# Altium schematic sheet STM32F103C8T6.SchDoc
size A3; SheetNumber: 1; SheetTotal: 6
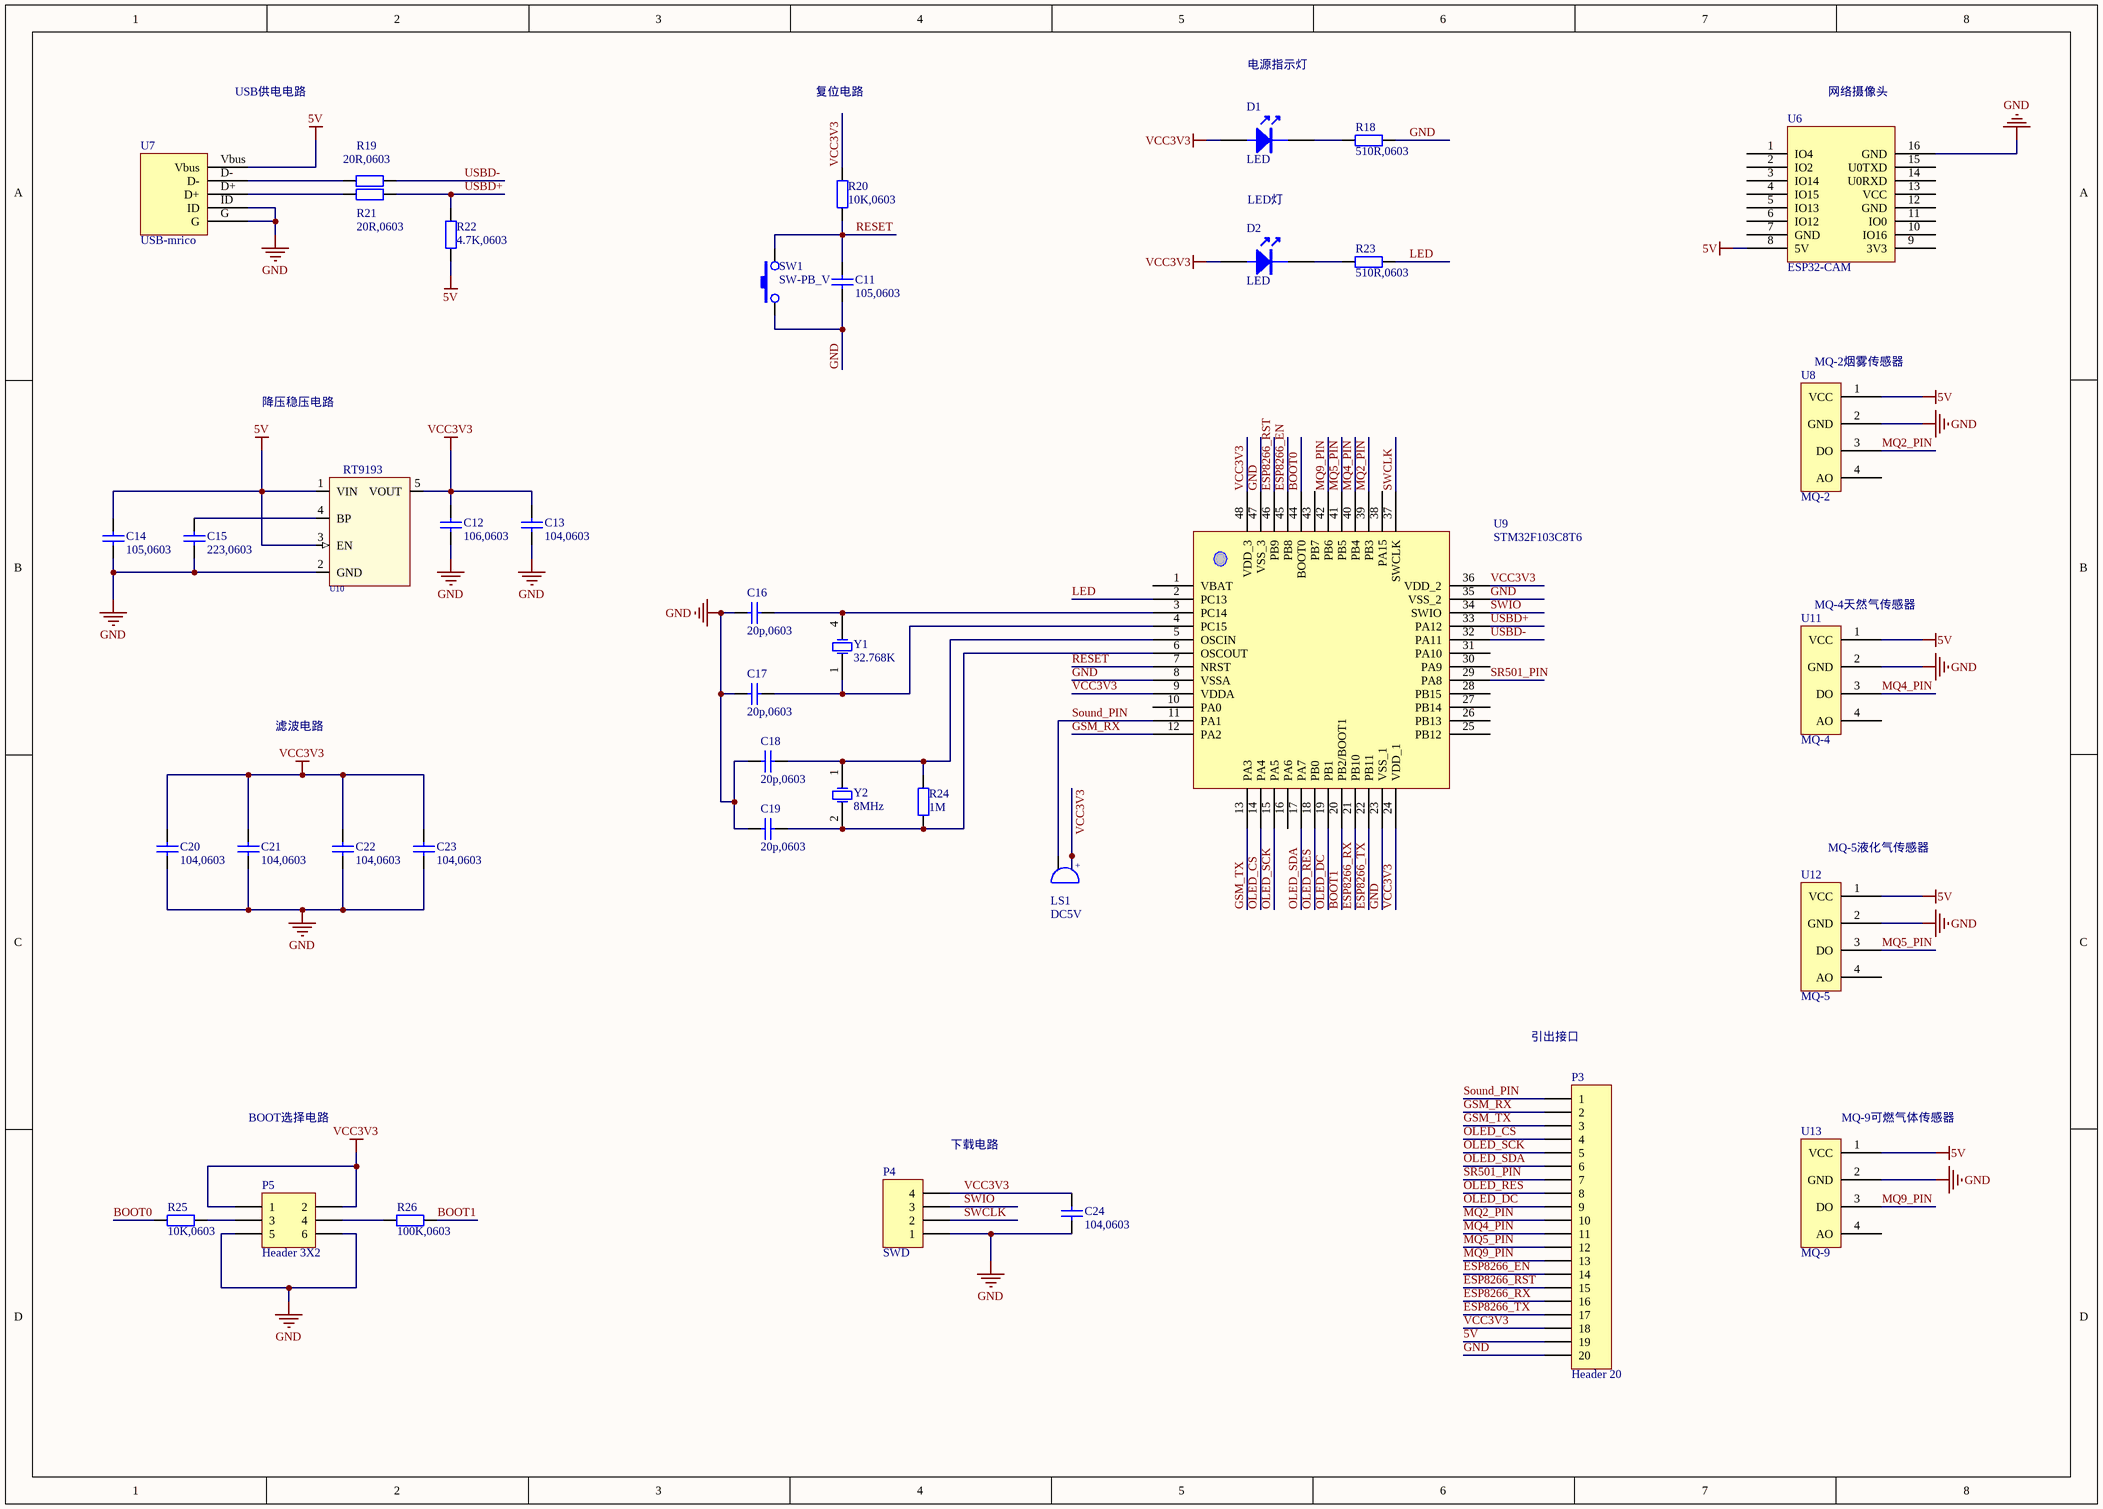
[diagram p0: STM32F103C8T6.SchDoc]

## Parts
C11  105,0603  [C0603]
C12  106,0603  [C0603]
C13  104,0603  [C0603]
C14  105,0603  [C0603]
C15  223,0603  [C0603]
C16  20p,0603  [C0603]
C17  20p,0603  [C0603]
C18  20p,0603  [C0603]
C19  20p,0603  [C0603]
C20  104,0603  [C0603]
C21  104,0603  [C0603]
C22  104,0603  [C0603]
C23  104,0603  [C0603]
C24  104,0603  [C0603]
D1  LED  [LED]
D2  LED  [LED]
LS1  DC5V  [BEEP 5x9x5.5]
P3  Header 20  [HDR1X20]
P4  SWD  [HDR1X4]
P5  Header 3X2  [HDR2X3]
R18  510R,0603  [R0603]
R19  20R,0603  [R0603]
R20  10K,0603  [R0603]
R21  20R,0603  [R0603]
R22  4.7K,0603  [R0603]
R23  510R,0603  [R0603]
R24  1M  [R0603]
R25  10K,0603  [R0603]
R26  100K,0603  [R0603]
SW1  SW-PB_V  [KEY-SMT]
U6  ESP32-CAM
U7  USB-mrico  [Micro_USB]
U8  MQ-2
U9  STM32F103C8T6  [48P]
U10  RT9193  [SOT-23-5]
U11  MQ-4
U12  MQ-5
U13  MQ-9
Y1  32.768K  [X/2.5/2/6/2.5]
Y2  8MHz  [X/2.5/2/6/2.5]

## Nets
5V: C14.2 P3.19 R22.1 U6.8(5V) U7.Vbus U8.1(VCC) U10.1(VIN) U10.3(EN) U11.1(VCC) U12.1(VCC) U13.1(VCC)
GND: C11.1 C12.1 C13.1 C14.1 C15.1 C16.2 C17.2 C18.2 C19.2 C20.1 C21.1 C22.1 C23.1 C24.1 P3.20 P4.1 P5.5 P5.6 R18.2 SW1.1 U6.16(GND) U7.G U7.ID U8.2(GND) U9.8(VSSA) U9.23(VSS_1) U9.35(VSS_2) U9.47(VSS_3) U10.2(GND) U11.2(GND) U12.2(GND) U13.2(GND)
VCC3V3: C12.2 C13.2 C20.2 C21.2 C22.2 C23.2 C24.2 D1.A D2.A LS1.1 P3.18 P4.4 P5.1 P5.2 R20.2 U9.9(VDDA) U9.24(VDD_1) U9.36(VDD_2) U9.48(VDD_3) U10.5(VOUT)
BOOT0: R25.2 U9.44(BOOT0)
BOOT1: R26.1 U9.20(PB2/BOOT1)
ESP8266_EN: P3.14 U9.45(PB8)
ESP8266_RST: P3.15 U9.46(PB9)
ESP8266_RX: P3.16 U9.21(PB10)
ESP8266_TX: P3.17 U9.22(PB11)
GSM_RX: P3.2 U9.12(PA2)
GSM_TX: P3.3 U9.13(PA3)
LED: R23.2 U9.2(PC13)
MQ2_PIN: P3.10 U8.3(DO) U9.39(PB3)
MQ4_PIN: P3.11 U9.40(PB4) U11.3(DO)
MQ5_PIN: P3.12 U9.41(PB5) U12.3(DO)
MQ9_PIN: P3.13 U9.42(PB6) U13.3(DO)
OLED_CS: P3.4 U9.14(PA4)
OLED_DC: P3.9 U9.19(PB1)
OLED_RES: P3.8 U9.18(PB0)
OLED_SCK: P3.5 U9.15(PA5)
OLED_SDA: P3.6 U9.17(PA7)
RESET: C11.2 R20.1 SW1.2 U9.7(NRST)
Sound_PIN: LS1.2 P3.1 U9.11(PA1)
SR501_PIN: P3.7 U9.29(PA8)
SWCLK: P4.2 U9.37(SWCLK)
SWIO: P4.3 U9.34(SWIO)
USBD+: R21.1 R22.2 U9.33(PA12)
USBD-: R19.2 U9.32(PA11)
NetC15_2: C15.2 U10.4(BP)
NetC16_1: C16.1 U9.3(PC14) Y1.4(OSC2)
NetC17_1: C17.1 U9.4(PC15) Y1.1(OSC1)
NetC18_1: C18.1 R24.2 U9.5(OSCIN) Y2.1(OSC1)
NetC19_1: C19.1 R24.1 U9.6(OSCOUT) Y2.2(OSC2)
NetD1_K: D1.K R18.1
NetD2_K: D2.K R23.1
NetP5_3: P5.3 R25.1
NetP5_4: P5.4 R26.2
NetR19_1: R19.1 U7.D-
NetR21_2: R21.2 U7.D+

Not connected (* = marked no-connect by the designer): U6 1(IO4) 2(IO2) 3(IO14) 4(IO15) 5(IO13) 6(IO12) 7(GND) 9(3V3) 10(IO16) 11(IO0) 12(GND) 13(VCC) 14(U0RXD) 15(U0TXD); U8 4(AO); U9 1(VBAT) 10(PA0) 16(PA6) 25(PB12) 26(PB13) 27(PB14) 28(PB15) 30(PA9) 31(PA10) 38(PA15) 43(PB7); U11 4(AO); U12 4(AO); U13 4(AO)

## Notes on the sheet
- USB供电电路
- 复位电路
- 电源指示灯
- 网络摄像头
- LED灯
- (near U8) MQ-2烟雾传感器
- 降压稳压电路
- (near U11) MQ-4天然气传感器
- 滤波电路
- (near U12) MQ-5液化气传感器
- 引出接口
- BOOT选择电路
- (near U13) MQ-9可燃气体传感器
- (near P4) 下载电路
- (in symbol BEEP) +

## Library data of the parts
C11-C24 = Cap: Capacitor; Value: 104; Published: 8-Jun-2000; LatestRevisionDate: 17-Jul-2002; LatestRevisionNote: Re-released for DXP Platform.; Publisher: Altium Limited
D1 D2 = LED: pin to pad: A>1 K>2
LS1 = BEEP: 蜂鸣器; 联系下单店铺卖家 免费技术支持: 联系下单店铺卖家 免费帮你查找封装; BOM名称: 蜂鸣器
P3 = Header 20: Header, 20-Pin; LatestRevisionDate: 17-Jul-2002; LatestRevisionNote: Re-released for DXP Platform.; Publisher: Altium Limited
P4 = Header 4: Header, 4-Pin; LatestRevisionDate: 17-Jul-2002; LatestRevisionNote: Re-released for DXP Platform.; Publisher: Altium Limited
P5 = Header 3X2: Header, 3-Pin, Dual row; LatestRevisionDate: 17-Jul-2002; LatestRevisionNote: Re-released for DXP Platform.; Publisher: Altium Limited
R18-R26 = Res2: Resistor; Published: 8-Jun-2000; LatestRevisionDate: 17-Jul-2002; LatestRevisionNote: Re-released for DXP Platform.; Publisher: Altium Limited
SW1 = SW-PB_V: SWITCH
U7 = usb-STM
U10 = RT9193X_5P: ICA_MFR_NAME: RICHTEK; ICA_PARTNUM: $$2191094$$RT9193-15CU5; Part Number: TMP-13
Y1 Y2 = XTAL: Crystal Oscillator; Published: 8-Jun-2000; LatestRevisionDate: 17-Jul-2002; LatestRevisionNote: Re-released for DXP Platform.; Publisher: Altium Limited